# Altium schematic sheet Half-Bridge.SchDoc
size A4
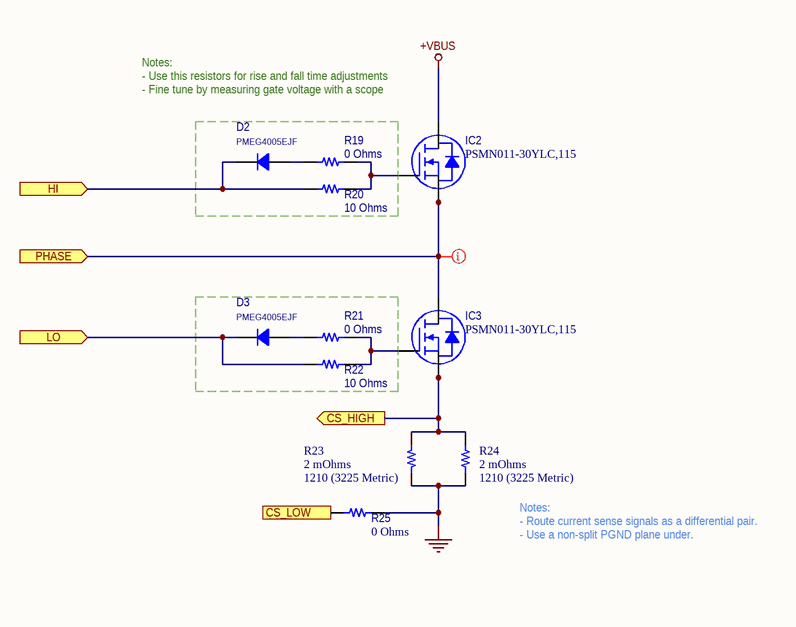
[diagram p0: Half-Bridge.SchDoc]

## Parts
D2  PMEG4005EJF  [SOD323F]
D3  PMEG4005EJF  [SOD323F]
IC2  PSMN011-30YLC,115  [NXP LFPAK56 SOT669]
IC3  PSMN011-30YLC,115  [NXP LFPAK56 SOT669]
R19  0 Ohms  [RES 0402_1005]
R20  10 Ohms  [RES 0402_1005]
R21  0 Ohms  [RES 0402_1005]
R22  10 Ohms  [RES 0402_1005]
R23  2 mOhms  Device Package: 1210 (3225 Metric)  [RES 1210_3225]
R24  2 mOhms  Device Package: 1210 (3225 Metric)  [RES 1210_3225]
R25  0 Ohms  [RES 0603_1608]

## Ports
CS_HIGH (out), CS_LOW (out), HI (in), LO (in), PHASE (in)

## Nets
+VBUS: IC2.5(D)
GND: R23.1 R24.1 R25.2
CS_HIGH: IC3.1(S) IC3.2(S) IC3.3(S) R23.2 R24.2 ; port CS_HIGH
CS_LOW: R25.1 ; port CS_LOW
HI: D2.2 R20.1 ; port HI
LO: D3.2 R22.1 ; port LO
PHASE: IC2.1(S) IC2.2(S) IC2.3(S) IC3.5(D) ; port PHASE
NetD2_1: D2.1 R19.1
NetD3_1: D3.1 R21.1
NetIC2_4: IC2.4(G) R19.2 R20.2
NetIC3_4: IC3.4(G) R21.2 R22.2

## Layout directives
net class HIGH_V: PHASE

## Notes on the sheet
- Notes:
  - Use this resistors for rise and fall time adjustments
  - Fine tune by measuring gate voltage with a scope
- Notes:
  - Route current sense signals as a differential pair.
  - Use a non-split PGND plane under.

## Library data of the parts
D2 D3 = PMEG4005EJF: PMEG4005EJ/SOD323/SOD2; Manufacturer: Nexperia USA Inc.; Capacitance @ Vr, F: 510pF @ 1V, 1MHz; Current - Average Rectified (Io): 500mA (DC); Current - Reverse Leakage @ Vr: 100µA @ 40V; Diode Type: Schottky; Speed: Fast Recovery =< 500ns, > 200mA (Io); Voltage - DC Reverse (Vr) (Max): 40V; Voltage - Forward (Vf) (Max) @ If: 470mV @ 500mA; Part Number: PMEG4005EJF; ComponentLink1Description: Datasheet; ComponentLink1URL: https://assets.nexperia.com/documents/data-sheet/PMEGXX05EH_EJ_SER.pdf; ComponentLink2Description: DigiKey Link; ComponentLink2URL: http://digikey.com/product-detail/en/nexperia-usa-inc/PMEG4005EJF/1727-8451-6-ND/9759625; Device Package: SC-90, SOD-323F; LastUpdated: 1/21/2020 2:44:13 AM; Lifecycle Status: Active; Minimum Order: 1; Mounting Type: Surface Mount; Operating Temperature - Junction: 150°C (Max); Package / Case: SC-90, SOD-323F; PartId: 2591; Part Status: Active; Price: 0; Series: -; Supplier 1: DigiKey; Supplier Part Number 1: 1727-8451-6-ND; Supplier Device Package: SOD-323F
IC2 IC3 = PSMN011-30YLC,115: MOSFET N-CH 30V 37A LFPAK; Manufacturer: Nexperia USA Inc.; Current - Continuous Drain (Id) @ 25°C: 37A (Tc); Drive Voltage (Max Rds On,  Min Rds On): 4.5V, 10V; FET Type: N-Channel; Gate Charge (Qg) (Max) @ Vgs: 10.3nC @ 10V; Input Capacitance (Ciss) (Max) @ Vds: 641pF @ 15V; Power Dissipation (Max): 29W (Tc); Rds On (Max) @ Id, Vgs: 11.6mOhm @ 10A, 10V; Vgs (Max): ±20V; Vgs(th) (Max) @ Id: 1.95V @ 1mA; Part Number: PSMN011-30YLC,115; ComponentLink1Description: Datasheet; ComponentLink1URL: https://assets.nexperia.com/documents/data-sheet/PSMN011-30YLC.pdf; ComponentLink2Description: DigiKey Link; ComponentLink2URL: http://digikey.com/product-detail/en/nexperia-usa-inc/PSMN011-30YLC115/1727-6495-1-ND/2785363; Device Package: SC-100, SOT-669; Drain to Source Voltage (Vdss): 30V; LastUpdated: 2/4/2020 3:06:20 AM; Lifecycle Status: Active; Minimum Order: 1; Mounting Type: Surface Mount; Operating Temperature: -55°C ~ 175°C (TJ); Package / Case: SC-100, SOT-669; Packaging: TapeAndReel; Part Status: Active; Price: 0.19; Series: -; Supplier 1: DigiKey; Supplier Part Number 1: 1727-6495-1-ND; Supplier Device Package: LFPAK56, Power-SO8; Technology: MOSFET (Metal Oxide)
R19 R21 = CR0402AJ/-000GAS: RESA-AS 0402 0R JUMPER 63MW; Manufacturer: Bourns Inc.; Power (Watts): 0.063W, 1/16W; Part Number: CR0402AJ/-000GAS; Value: 0 Ohms; ComponentLink1Description: Datasheet; ComponentLink1URL: //media.digikey.com/pdf/Data%20Sheets/Bourns%20PDFs/CRyyyyA-AS_Model_DS.pdf; ComponentLink2Description: DigiKey Link; ComponentLink2URL: http://digikey.com/product-detail/en/bourns-inc/CR0402AJ-000GAS/CR0402AJ-000GASCT-ND/10240164; Composition: Thick Film; Device Package: 0402 (1005 Metric); Features: Anti-Sulfur, Automotive AEC-Q200, Moisture Resistant; Height - Seated (Max): 0.015" (0.37mm); LastUpdated: 1/21/2020 12:05:54 AM; Lifecycle Status: Active; Minimum Order: 1; Number of Terminations: 2; Operating Temperature: -55°C ~ 155°C; Package / Case: 0402 (1005 Metric); Packaging: TapeAndReel; PartId: 7106; Part Status: Active; Price: 0.01; Ratings: AEC-Q200; Resistance: 0 Ohms; Series: CR0402A-AS; Size / Dimension: 0.039" L x 0.020" W (1.00mm x 0.50mm); Supplier 1: DigiKey; Supplier Part Number 1: CR0402AJ/-000GASCT-ND; Supplier Device Package: 0402; Tolerance: Jumper
R20 R22 = RR0510R-100-D: RES SMD 10 OHM 0.5% 1/16W 0402; Manufacturer: Susumu; Power (Watts): 0.063W, 1/16W; Temperature Coefficient: ±100ppm/°C; Part Number: RR0510R-100-D; Value: 10 Ohms; ComponentLink1Description: Datasheet; ComponentLink1URL: http://www.susumu.co.jp/common/pdf/n_catalog_partition05_en.pdf; ComponentLink2Description: DigiKey Link; ComponentLink2URL: http://digikey.com/product-detail/en/susumu/RR0510R-100-D/RR05R10DCT-ND/432902; Composition: Thin Film; Device Package: 0402 (1005 Metric); Height - Seated (Max): 0.016" (0.40mm); LastUpdated: 1/21/2020 12:06:02 AM; Lifecycle Status: Active; Minimum Order: 1; Number of Terminations: 2; Operating Temperature: -55°C ~ 125°C; Package / Case: 0402 (1005 Metric); Packaging: TapeAndReel; PartId: 3233; Part Status: Active; Price: 0.01; Resistance: 10 Ohms; Series: RR; Size / Dimension: 0.039" L x 0.020" W (1.00mm x 0.50mm); Supplier 1: DigiKey; Supplier Part Number 1: RR05R10DCT-ND; Tolerance: ±0.5%
R23 R24 = PMR25HZPFV2L00: RES 0.002 OHM 1% 1W 1210; Manufacturer: Rohm Semiconductor; Temperature Coefficient: ±100ppm/°C; Part Number: PMR25HZPFV2L00; ComponentLink1Description: Datasheet; ComponentLink1URL: https://www.rohm.com/datasheet/PMR18EZPFV/pmr-e; ComponentLink2Description: DigiKey Link; ComponentLink2URL: http://digikey.com/product-detail/en/rohm-semiconductor/PMR25HZPFV2L00/RHM.002APCT-ND/2094531; Composition: Thick Film; Features: Automotive AEC-Q200, Current Sense; Height - Seated (Max): 0.019" (0.47mm); LastUpdated: 8/30/2020 9:05:59 PM; Lifecycle Status: Active; Minimum Order: 1; Number of Terminations: 2; Operating Temperature: -55°C ~ 155°C; Package / Case: 1210 (3225 Metric); Packaging: TapeAndReel; Part Status: Active; Power (Watts): 1W; Price: 0.19; Ratings: AEC-Q200; Resistance: 2 mOhms; Series: PMR; Size / Dimension: 0.126" L x 0.098" W (3.20mm x 2.50mm); Supplier 1: DigiKey; Supplier Part Number 1: RHM.002APCT-ND; Supplier Device Package: 1210; Tolerance: ±1%; Value: 2 mOhms
R25 = CRCW06030000Z0EAHP: RES SMD 0 OHM JUMPER 1/4W 0603; Manufacturer: Vishay Dale; Power (Watts): 0.25W, 1/4W; Part Number: CRCW06030000Z0EAHP; Value: 0 Ohms; ComponentLink1Description: Datasheet; ComponentLink1URL: http://www.vishay.com/docs/20043/crcwhpe3.pdf; ComponentLink2Description: DigiKey Link; ComponentLink2URL: http://digikey.com/product-detail/en/vishay-dale/CRCW06030000Z0EAHP/541-0.0SBCT-ND/2222749; Composition: Thick Film; Device Package: 0603 (1608 Metric); Features: Automotive AEC-Q200, Pulse Withstanding; Height - Seated (Max): 0.022" (0.55mm); LastUpdated: 9/2/2020 1:10:23 AM; Lifecycle Status: Active; Minimum Order: 1; Number of Terminations: 2; Operating Temperature: -55°C ~ 155°C; Package / Case: 0603 (1608 Metric); Packaging: TapeAndReel; PartId: 5474; Part Status: Active; Price: 0.02; Ratings: AEC-Q200; Resistance: 0 Ohms; Series: CRCW-HP; Size / Dimension: 0.063" L x 0.033" W (1.60mm x 0.85mm); Supplier 1: DigiKey; Supplier Part Number 1: 541-0.0SBCT-ND; Supplier Device Package: 0603; Tolerance: Jumper